# EAGLE design Patch panel module - De-normalled (EAGLE 7.2.0)
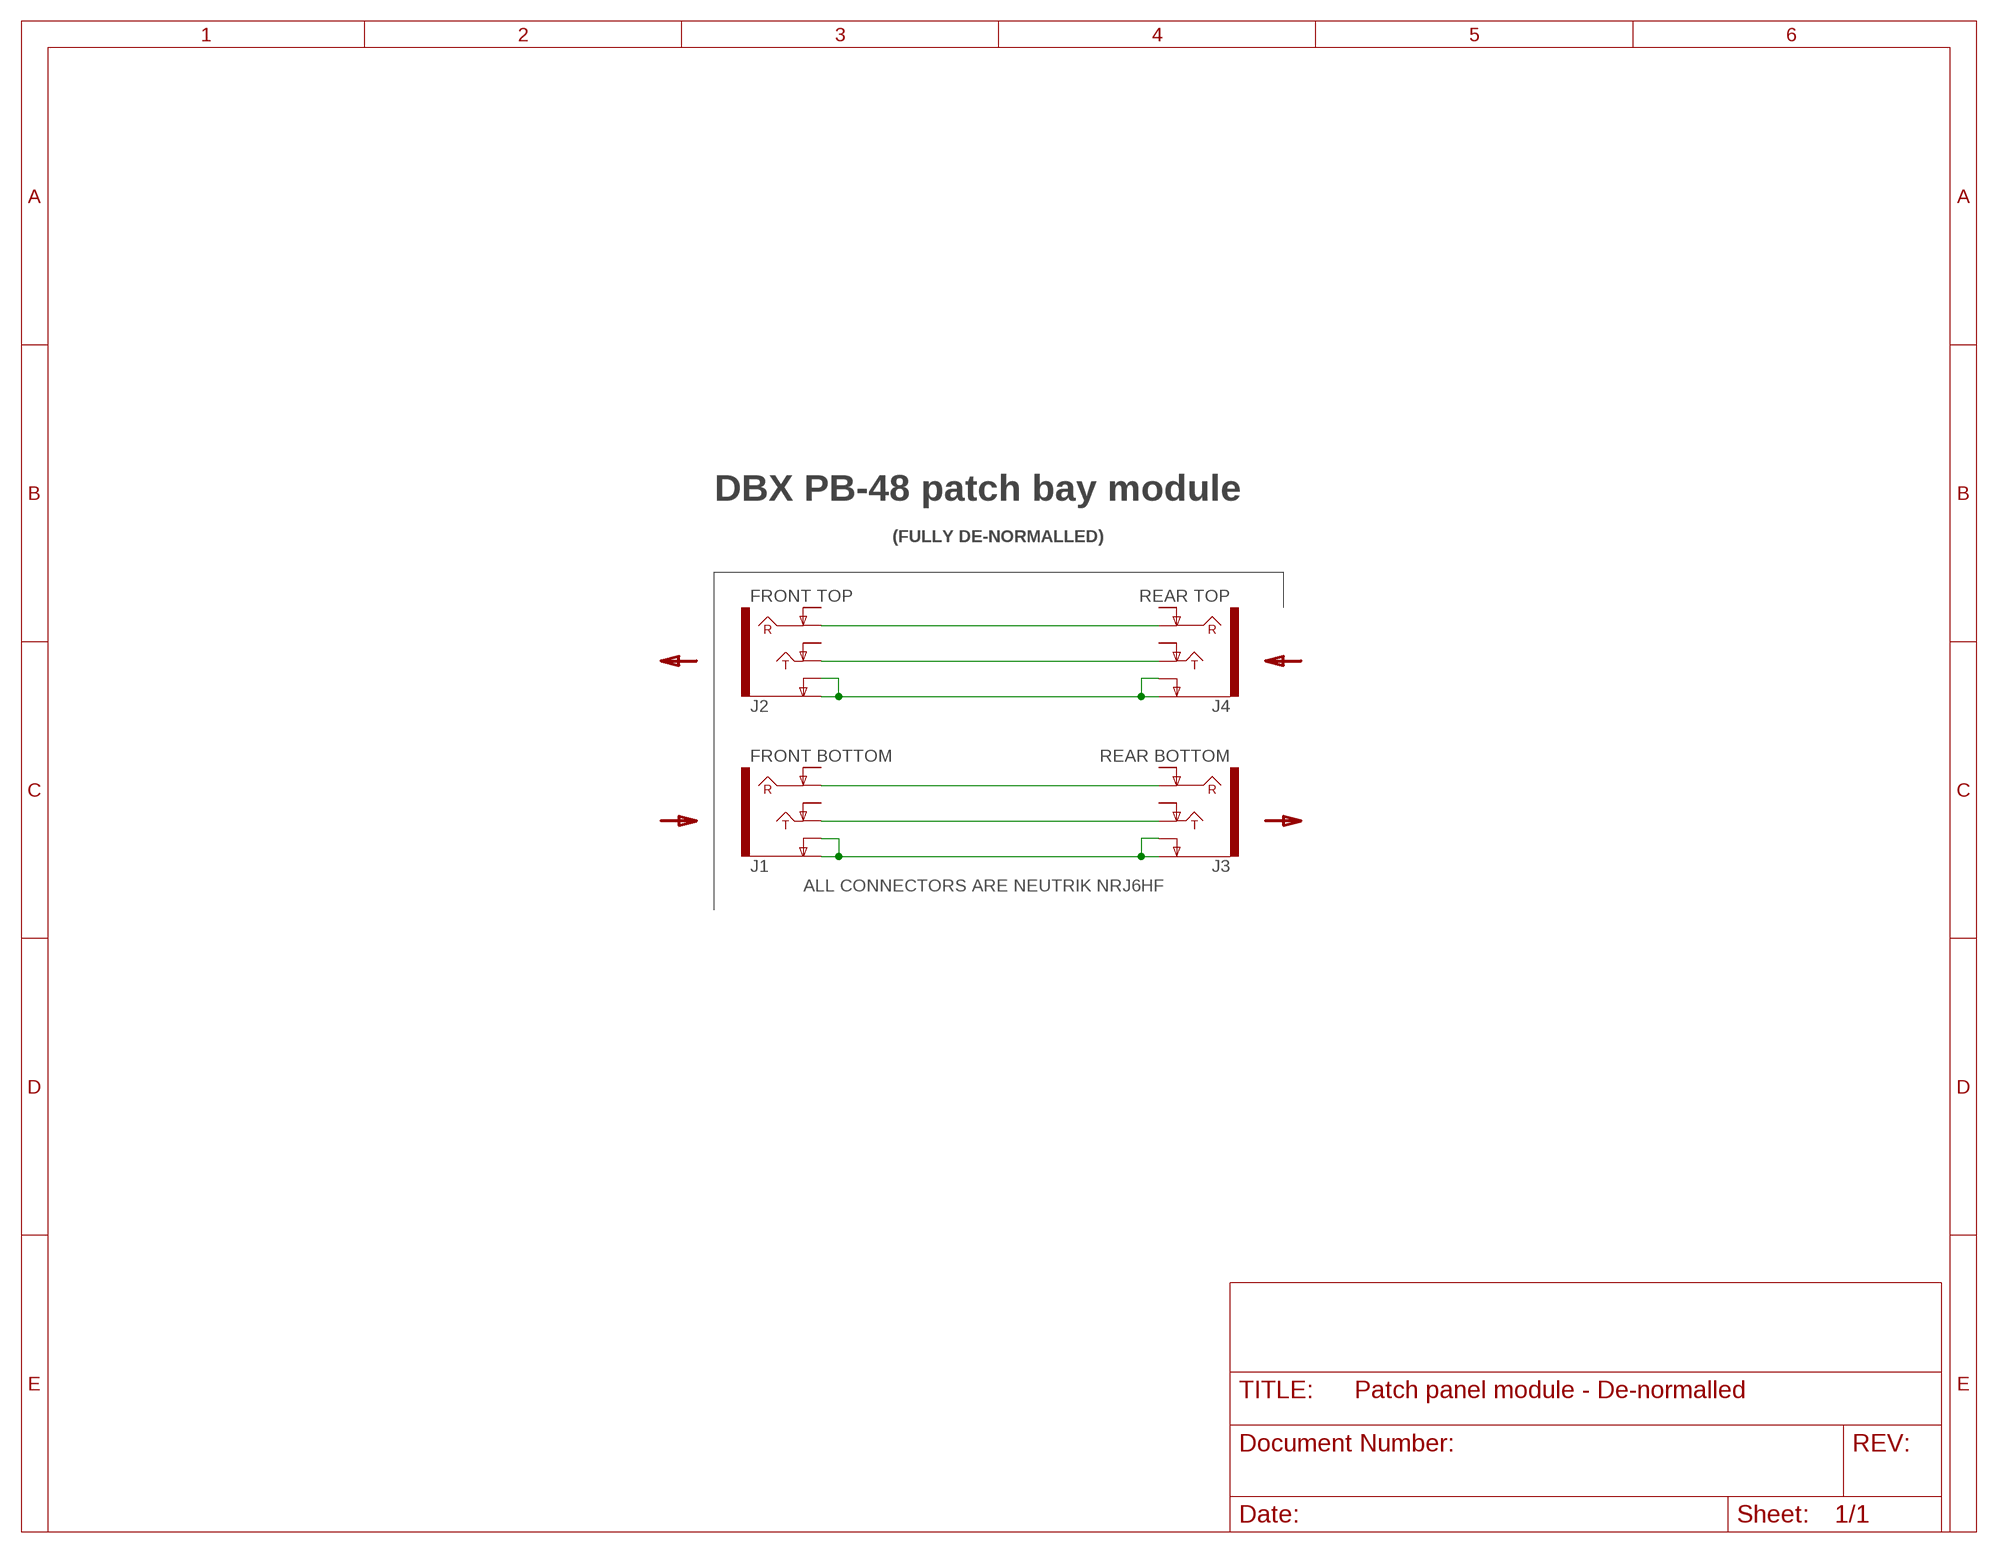
[diagram p0: schematic, sheet 1]

## Parts
J1  FRONT BOTTOM  AUDIO_JACK_TRS_0.25"_PTH_RA-NRJ6HM  [NEUTRIK-NRJ6HF]
J2  FRONT TOP  AUDIO_JACK_TRS_0.25"_PTH_RA-NRJ6HM  [NEUTRIK-NRJ6HF]
J3  REAR BOTTOM  AUDIO_JACK_TRS_0.25"_PTH_RA-NRJ6HM  [NEUTRIK-NRJ6HF]
J4  REAR TOP  AUDIO_JACK_TRS_0.25"_PTH_RA-NRJ6HM  [NEUTRIK-NRJ6HF]

## Nets
N$1: J2.S(EARTH) J2.SN(EARTH-NORM) J4.S(EARTH) J4.SN(EARTH-NORM)
N$2: J2.R(RING) J4.R(RING)
N$3: J2.T(TIP) J4.T(TIP)
N$4: J1.R(RING) J3.R(RING)
N$5: J1.T(TIP) J3.T(TIP)
N$6: J1.S(EARTH) J1.SN(EARTH-NORM) J3.S(EARTH) J3.SN(EARTH-NORM)
Unconnected: J1.RN(RING-NORM) J1.TN(TIP-NORM) J2.RN(RING-NORM) J2.TN(TIP-NORM) J3.RN(RING-NORM) J3.TN(TIP-NORM) J4.RN(RING-NORM) J4.TN(TIP-NORM)

## Notes on the sheet
- DBX PB-48 patch bay module
- (FULLY DE-NORMALLED)
- ALL CONNECTORS ARE NEUTRIK NRJ6HF

## Library data of the parts
J1-J4 = !frankendeck:AUDIO_JACK_TRS_0.25"_PTH_RA: Audio Jack, 1/4" TRS jack, horizontal, PTH, aka "Phono jack" Find the connector here: Audio Jack - 1/4" Stereo (right angle) <https://www.sparkfun.com/products/11144> (COM-11144) Datasheet <http://cdn.sparkfun.com/datasheets/Components/General/JP-611%20DD.jpg> Note, although the datasheet and physical part are slightly different, this footprint was proven to mate well on the Proto Pedal. This device is used on these SparkFun Products: SparkFun TRS Jack Breakout - 1/4" Stereo <https://www.sparkfun.com/products/13005> (BOB-13005 ) SparkFun Proto Pedal - sorry bad link - product comming soon! <https://www.sparkfun.com/products/13124> (PRT-13124); PROD_ID: CONN-12339; SF_ID: COM-11144

## Board
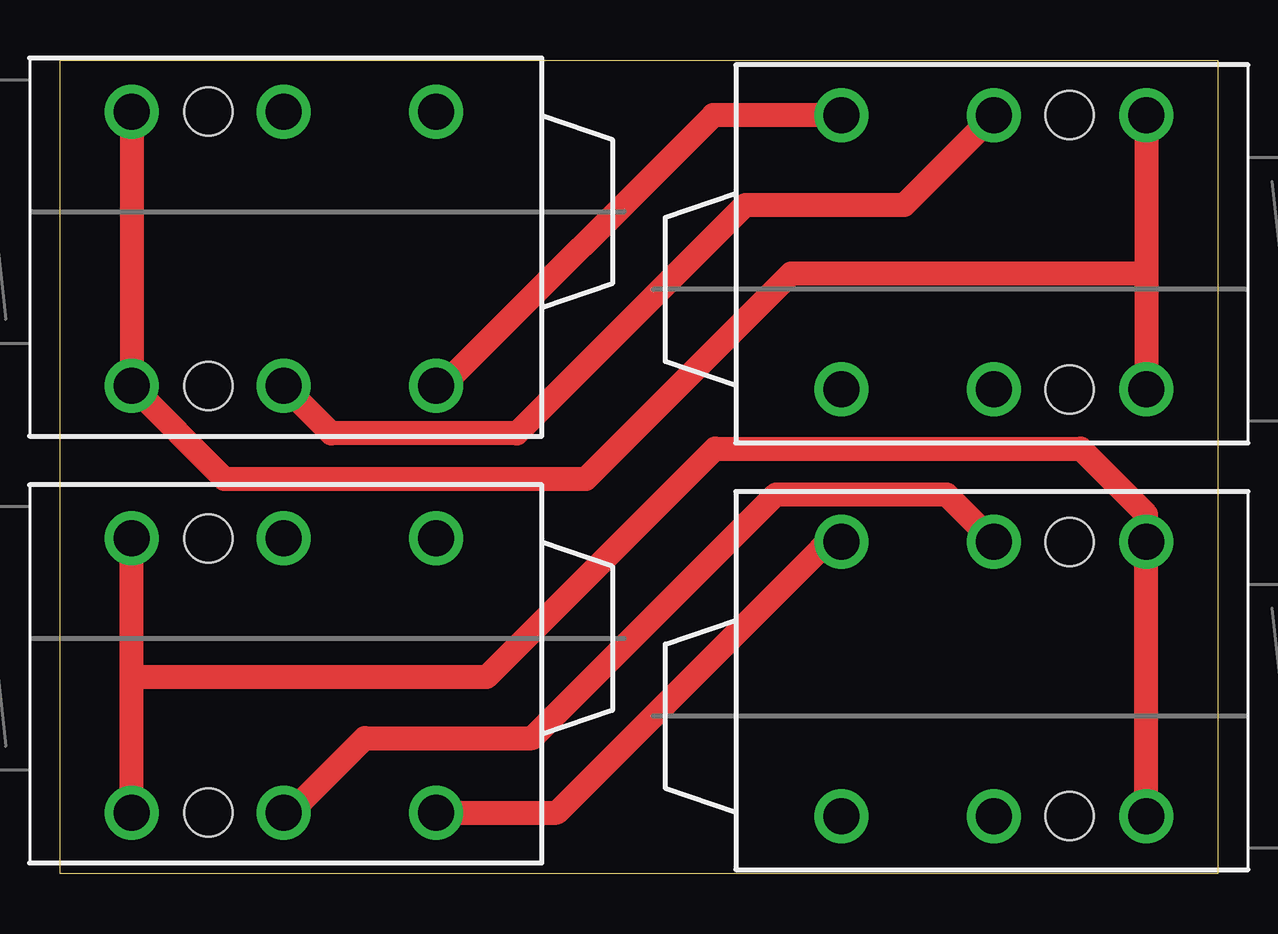
[diagram p1: board, top side]

Size 48.26 x 33.91 mm. Coordinates in mm from the lower left corner, seen from the top.
Outline: 0,33.91 48.26,33.91 48.26,0 0,0 0,33.91
Copper layers (1*16): Top 0.0356mm / dielectric 1.5011mm / Bottom 0.0356mm
Design rules "oshpark-2layer_NJ": minimum track width 6mil, minimum drill 10mil, track to track 6mil, track to pad 6mil, pad to pad 6mil, via to via 6mil, smd to smd 6mil, copper to edge 15mil, drill to drill 6mil, minimum pad ring 7mil, minimum via ring 7mil, stop-mask expansion 2.5mil, vias tented up to drill 100mil, thermal gap 10mil

### Footprints (pad centres in the part's own frame; a part is rotated, then mirrored left to right if it is on the bottom)
NEUTRIK-NRJ6HF = drill 1.5: R -10.6,7.23; RN -10.6,-4.2; S -4.25,7.23; SN -4.25,-4.2; T -16.95,7.23; TN -16.95,-4.2 | hole 2: -7.45,7.23; -7.45,-4.2

### Placement (x,y rotation side)
J1  -1.27,9.78 180 top
J2  -1.27,27.56 180 top
J3  49.53,6.6 0 top
J4  49.53,24.38 0 top

### Tracks (layer width: path | path; a pad name or v marks a point on that pad's centre or on a via)
N$1
  Top 1: J2.SN J2.S 6.86,16.45 21.91,16.45 30.48,25.02 45.22,25.02 45.28,24.95 | J4.S 45.28,24.95 | 45.28,24.95 J4.SN
N$2
  Top 1: J4.R 35.19,27.88 28.57,27.88 19.05,18.35 11.31,18.35 J2.R
N$3
  Top 1: J2.T 16.23,20.61 27.23,31.61 J4.T
N$4
  Top 1: J1.R 9.88,2.83 12.7,5.65 19.68,5.65 29.84,15.81 36.95,15.81 J3.R
N$5
  Top 1: J3.T 31.71,13.55 20.71,2.55 J1.T
N$6
  Top 1: J1.S 2.98,7.95 | 2.98,7.95 J1.SN | 2.98,7.95 3.22,8.19 17.78,8.19 27.3,17.72 42.55,17.72 45.28,14.98 J3.S J3.SN